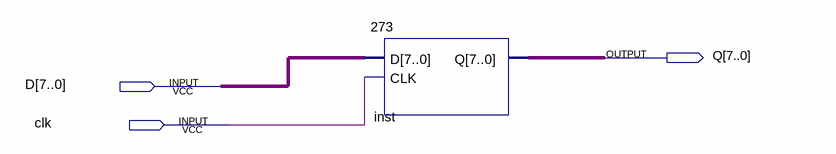
[diagram p0: schematic sheet]
// Quartus schematic lab0.bdf as structural Verilog: 1 symbols, 3 pins
module lab0 (
  input  [7:0] D,
  input  clk,
  output [7:0] Q
);

  \273  inst (.D(D), .CLK(clk), .Q(Q));
endmodule
